# Altium schematic sheet BMS ERROR Detection.SchDoc
size 223 x 132 mm; Origin: Eagle
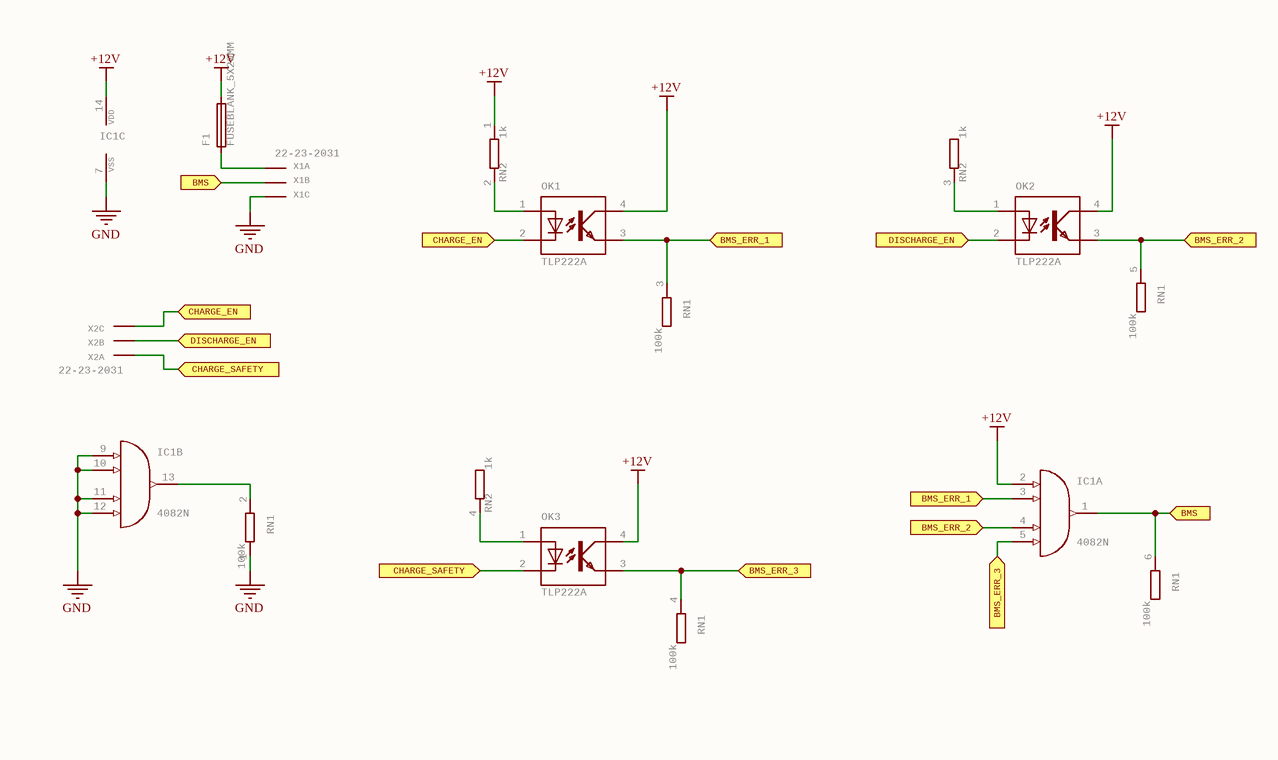
[diagram p0: BMS ERROR Detection.SchDoc]

## Parts
F1  FUSEBLANK_5X20MM  [FUSE_HOLDER_5X20MM]
IC1  4082N  [DIL14]  (parts A,B,C of 3)
OK1  TLP222A  [DIL04]
OK2  TLP222A  [DIL04]
OK3  TLP222A  [DIL04]
RN1  100k  PART: RN1  [SIL6]  (parts A,B,C,D,E of 5)
RN2  1k  PART: RN2  [SIL4]  (parts A,B,C of 3)
X1  22-23-2031  [22-23-2031]  (parts A,B,C of 3)
X2  22-23-2031  [22-23-2031]  (parts A,B,C of 3)

## Ports
BMS (in), BMS_ERR_1 (in), BMS_ERR_2 (in), BMS_ERR_3 (in), CHARGE_EN (in), CHARGE_SAFETY (in), DISCHARGE_EN (in)

## Nets
+12V: F1.2 IC1.2(I0) IC1.14(VDD) OK1.4(COL) OK2.4(COL) OK3.4(COL) RN2.1
GND: IC1.7(VSS) IC1.9(I0) IC1.10(I1) IC1.11(I2) IC1.12(I3) RN1.1 X1.3(S)
BMS: IC1.1(O) RN1.6 X1.2(S) ; port BMS
BMS_ERR_1: IC1.3(I1) OK1.3(EMIT) RN1.3 ; port BMS_ERR_1
BMS_ERR_2: IC1.4(I2) OK2.3(EMIT) RN1.5 ; port BMS_ERR_2
BMS_ERR_3: IC1.5(I3) OK3.3(EMIT) RN1.4 ; port BMS_ERR_3
CHARGE_EN: OK1.2(C) X2.3(S) ; port CHARGE_EN
CHARGE_SAFETY: OK3.2(C) X2.1(S) ; port CHARGE_SAFETY
DISCHARGE_EN: OK2.2(C) X2.2(S) ; port DISCHARGE_EN
NetF1_1: F1.1 X1.1(S)
NetIC1_13: IC1.13(O) RN1.2
NetOK1_1: OK1.1(A) RN2.2
NetOK2_1: OK2.1(A) RN2.3
NetOK3_1: OK3.1(A) RN2.4

## Library data of the parts
F1 = FUSEBLANK_5X20MM: Fuse; GateName_1: G$1; SymbolName_1: FUSE; DeviceName: BLANK_5X20MM; LibraryName: fuse; DeviceSetName: FUSE; MF: MF; MPN: MPN; OC_FARNELL: unknown; OC_NEWARK: unknown
IC1 = 4082N: Dual 4-input AND; GateName_1: A; SymbolName_1: 4082; GateName_2: B; GateName_3: P; SymbolName_3: PWRN; DeviceName: N; SymbolName_2: 4082; LibraryName: 40xx; DeviceSetName: 4082
OK1-OK3 = LTV816: OPTO COUPLER   Source: LITEON, LTV816.pdf; GateName_1: G$1; SymbolName_1: OK; LibraryName: optocoupler; DeviceSetName: LTV816; MF: MF; MPN: MPN; OC_FARNELL: unknown; OC_NEWARK: unknown
RN1 = GE05RP: SIL RESISTOR; GateName_1: A; SymbolName_1: R-PV; GateName_2: B; SymbolName_2: R-PV1; GateName_3: C; GateName_4: D; GateName_5: E; SymbolName_3: R-PV1; SymbolName_4: R-PV1; SymbolName_5: R-PV1; LibraryName: resistor-sil; DeviceSetName: GE05RP; MF: MF; MPN: MPN; OC_FARNELL: unknown; OC_NEWARK: unknown
RN2 = GE03RP: SIL RESISTOR; GateName_1: A; SymbolName_1: R-PV; GateName_2: B; SymbolName_2: R-PV1; GateName_3: C; SymbolName_3: R-PV1; LibraryName: resistor-sil; DeviceSetName: GE03RP; MF: MF; MPN: MPN; OC_FARNELL: unknown; OC_NEWARK: unknown
X1 X2 = 22-23-2031: .100" (2.54mm) Center Header - 3 Pin; GateName_1: -1; SymbolName_1: MV; GateName_2: -2; SymbolName_2: M; GateName_3: -3; MF: MOLEX; SymbolName_3: M; LibraryName: con-molex; DeviceSetName: 22-23-2031; MPN: 22-23-2031; OC_FARNELL: 1462950; OC_NEWARK: 30C0862